# Altium schematic sheet 3_BLE.SchDoc: SHMP_MainBoard - Radio
size B; Author: Sébastien Gélinas; Organization: SmartHalo; Address1: 5445 de Gaspé; Address2: Montréal, QC; Address3: Canada; Address4: H2T 3B2; DocumentNumber: 4; Revision: 1; SheetNumber: 3; SheetTotal: 4
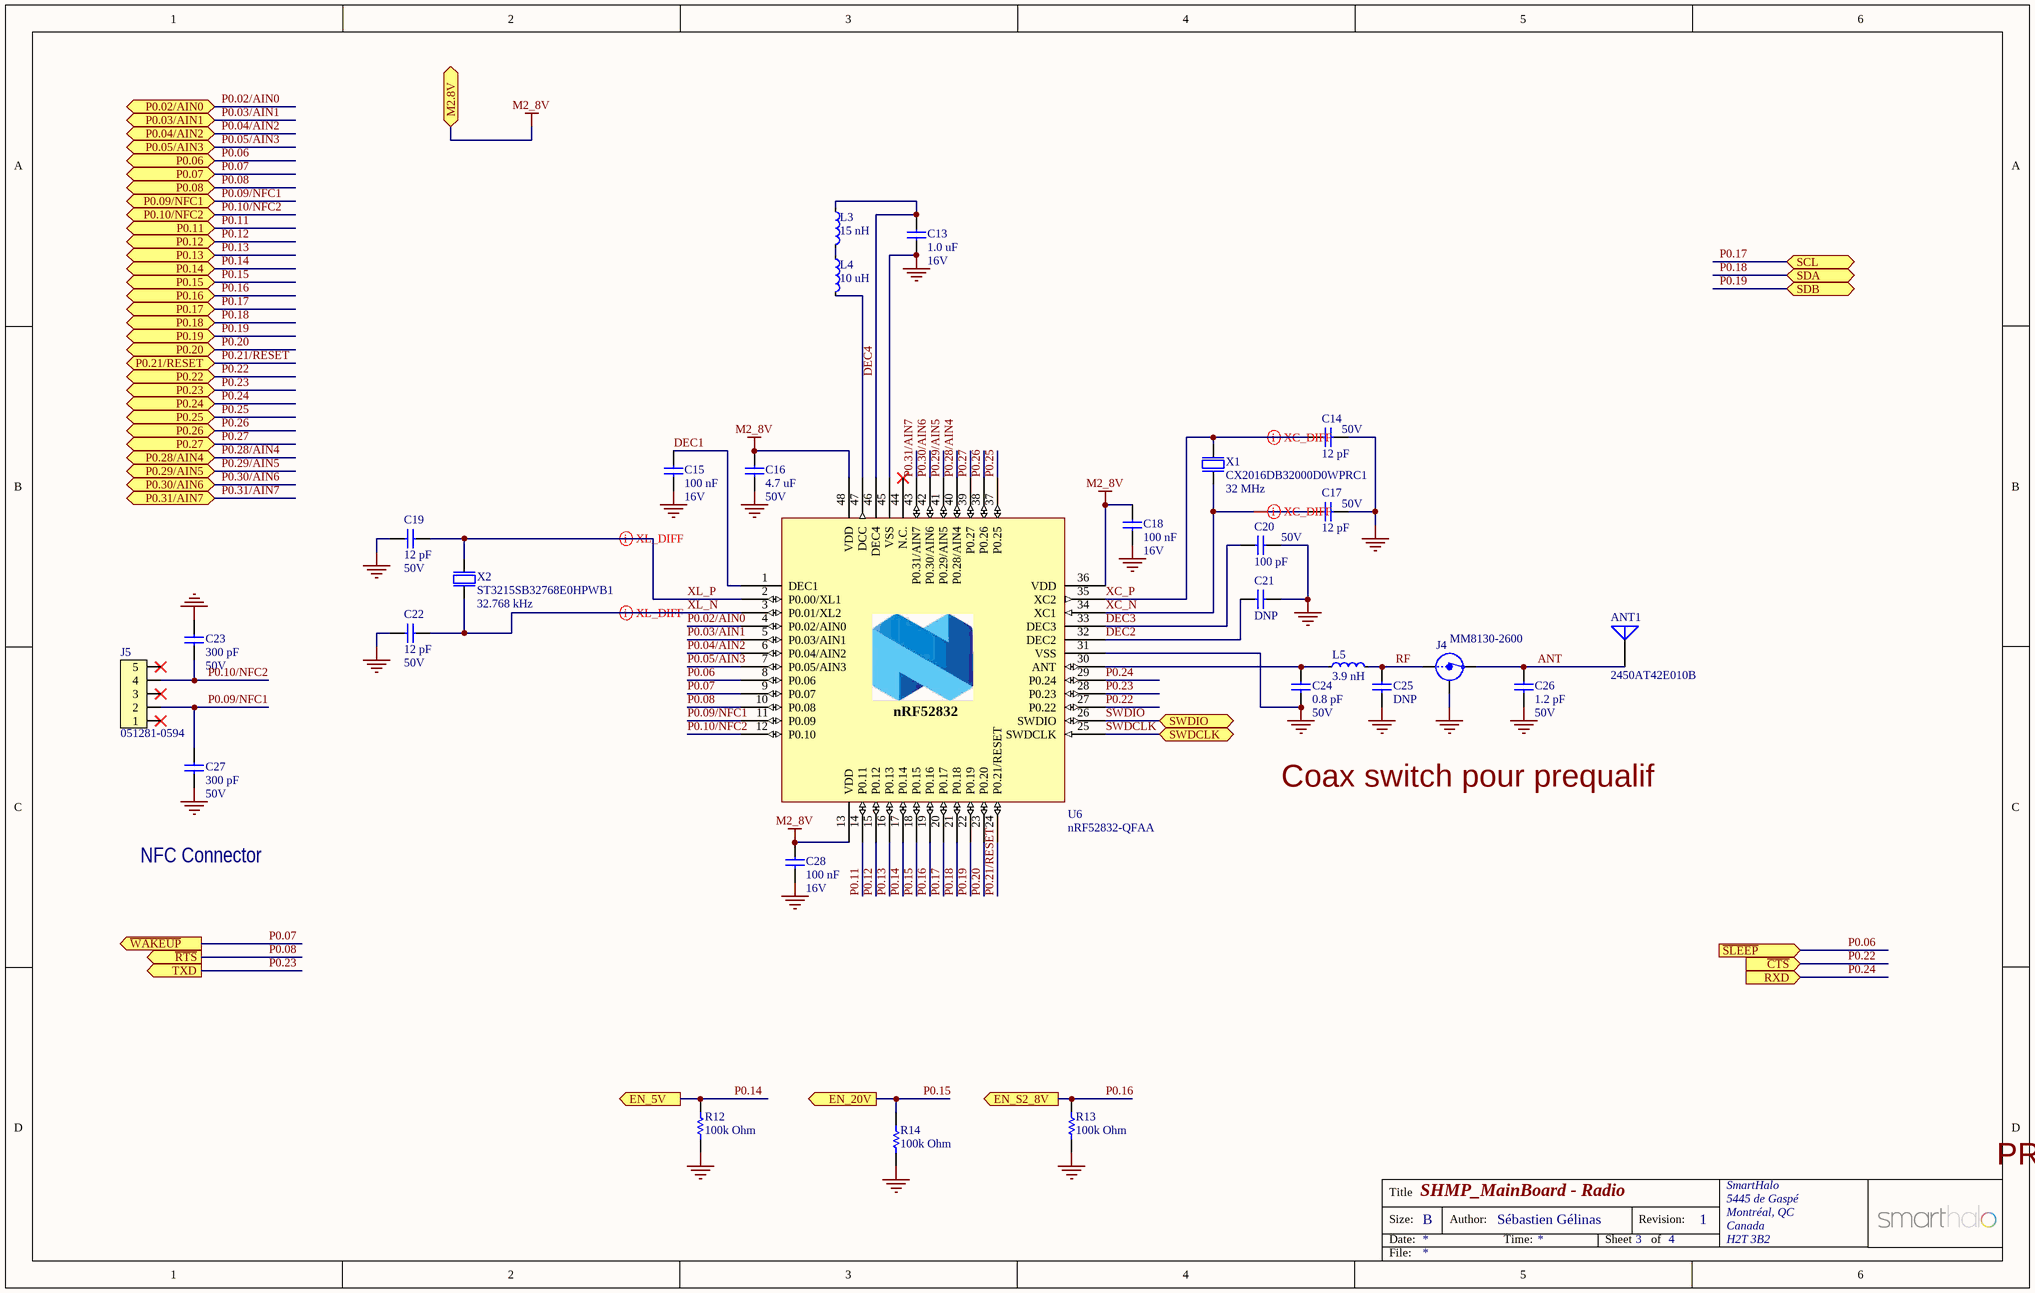
[diagram p0: 3_BLE.SchDoc]

## Parts
ANT1  2450AT42E010B  [2450AT42E010B]
C13  1.0 uF  Voltage Rating: 16V  [Varitron_CAP0603]
C14  12 pF  Voltage Rating: 50V  [Varitron_CAP0402]
C15  100 nF  Voltage Rating: 16V  [Varitron_CAP0402]
C16  4.7 uF  Voltage Rating: 50V  [Varitron_CAP0805]
C17  12 pF  Voltage Rating: 50V  [Varitron_CAP0402]
C18  100 nF  Voltage Rating: 16V  [Varitron_CAP0402]
C19  12 pF  Voltage Rating: 50V  [Varitron_CAP0402]
C20  100 pF  Voltage Rating: 50V  [Varitron_CAP0402]
C21  DNP  [Varitron_CAP0402]  (no BOM)
C22  12 pF  Voltage Rating: 50V  [Varitron_CAP0402]
C23  300 pF  Voltage Rating: 50V  [Varitron_CAP0402]
C24  0.8 pF  Voltage Rating: 50V  [Varitron_CAP0402]
C25  DNP  [Varitron_CAP0402]  (no BOM)
C26  1.2 pF  Voltage Rating: 50V  [Varitron_CAP0402]
C27  300 pF  Voltage Rating: 50V  [Varitron_CAP0402]
C28  100 nF  Voltage Rating: 16V  [Varitron_CAP0402]
J4  MM8130-2600  [COAXIAL-SWF]
J5  051281-0594  [Molex 051281-0594]
L3  15 nH  [Varitron_IND0402]
L4  10 uH  [Varitron_IND0603]
L5  3.9 nH  [Varitron_IND0402]
R12  100k Ohm  [Varitron_RES0402]
R13  100k Ohm  [Varitron_RES0402]
R14  100k Ohm  [Varitron_RES0402]
U6  nRF52832-QFAA  [QFN40P600X600X90-48N]
X1  CX2016DB32000D0WPRC1  Frequency: 32 MHz  [CRYSTAL_2016_4Pins]
X2  ST3215SB32768E0HPWB1  Frequency: 32.768 kHz  [CRYSTAL_3215_2Pins]

## Ports
EN_5V (out), EN_20V (out), EN_S2_8V (out), M2.8V, P0.02/AIN0, P0.03/AIN1, P0.04/AIN2, P0.05/AIN3, P0.06, P0.07, P0.08, P0.09/NFC1, P0.10/NFC2, P0.11, P0.12, P0.13, P0.14, P0.15, P0.16, P0.17, P0.18, P0.19, P0.20, P0.21/RESET, P0.22, P0.23, P0.24, P0.25, P0.26, P0.27, P0.28/AIN4, P0.29/AIN5, P0.30/AIN6, P0.31/AIN7, RXD (in), SCL (bidir), SDA (bidir), SDB (bidir), SWDCLK (bidir), SWDIO (bidir), TXD (out), ~{CTS} (in), ~{RTS} (out), ~{SLEEP} (in), ~{WAKEUP} (out)

## Nets
GND: ANT1.3(GND) ANT1.4(GND) C13.2 C14.2 C15.2 C16.2 C17.2 C18.2 C19.1 C20.2 C21.2 C22.1 C23.2 C24.1 C25.1 C26.1 C27.2 C28.2 J4.2(Shield) R12.1 R13.1 R14.2 U6.31(VSS) U6.45(VSS) U6.49(GND) X1.2(GND) X1.4(GND)
M2_8V: C16.1 C18.1 C28.1 U6.13(VDD) U6.36(VDD) U6.48(VDD) ; port M2.8V
ANT: ANT1.1(Feed) C26.2 J4.3(OUT)
DEC1: C15.1 U6.1(DEC1)
DEC2: C21.1 U6.32(DEC2)
DEC3: C20.1 U6.33(DEC3)
DEC4: C13.1 L3.1 U6.46(DEC4)
P0.02/AIN0: U6.4(P0.02/AIN0) ; port P0.02/AIN0
P0.03/AIN1: U6.5(P0.03/AIN1) ; port P0.03/AIN1
P0.04/AIN2: U6.6(P0.04/AIN2) ; port P0.04/AIN2
P0.05/AIN3: U6.7(P0.05/AIN3) ; port P0.05/AIN3
P0.06: U6.8(P0.06) ; port ~{SLEEP}, port P0.06
P0.07: U6.9(P0.07) ; port ~{WAKEUP}, port P0.07
P0.08: U6.10(P0.08) ; port ~{RTS}, port P0.08
P0.09/NFC1: C27.1 J5.2 U6.11(P0.09) ; port P0.09/NFC1
P0.10/NFC2: C23.1 J5.4 U6.12(P0.10) ; port P0.10/NFC2
P0.11: U6.14(P0.11) ; port P0.11
P0.12: U6.15(P0.12) ; port P0.12
P0.13: U6.16(P0.13) ; port P0.13
P0.14: R12.2 U6.17(P0.14) ; port EN_5V, port P0.14
P0.15: R14.1 U6.18(P0.15) ; port EN_20V, port P0.15
P0.16: R13.2 U6.19(P0.16) ; port EN_S2_8V, port P0.16
P0.17: U6.20(P0.17) ; port SCL, port P0.17
P0.18: U6.21(P0.18) ; port SDA, port P0.18
P0.19: U6.22(P0.19) ; port SDB, port P0.19
P0.20: U6.23(P0.20) ; port P0.20
P0.21/RESET: U6.24(P0.21/RESET) ; port P0.21/RESET
P0.22: U6.27(P0.22) ; port ~{CTS}, port P0.22
P0.23: U6.28(P0.23) ; port TXD, port P0.23
P0.24: U6.29(P0.24) ; port RXD, port P0.24
P0.25: U6.37(P0.25) ; port P0.25
P0.26: U6.38(P0.26) ; port P0.26
P0.27: U6.39(P0.27) ; port P0.27
P0.28/AIN4: U6.40(P0.28/AIN4) ; port P0.28/AIN4
P0.29/AIN5: U6.41(P0.29/AIN5) ; port P0.29/AIN5
P0.30/AIN6: U6.42(P0.30/AIN6) ; port P0.30/AIN6
P0.31/AIN7: U6.43(P0.31/AIN7) ; port P0.31/AIN7
RF: C25.2 J4.1(IN) L5.2
SWDCLK: U6.25(SWDCLK) ; port SWDCLK
SWDIO: U6.26(SWDIO) ; port SWDIO
XC_N: C17.1 U6.34(XC1) X1.3(out)
XC_P: C14.1 U6.35(XC2) X1.1(inp)
XL_N: C22.2 U6.3(P0.01/XL2) X2.2
XL_P: C19.2 U6.2(P0.00/XL1) X2.1
NetC24_2: C24.2 L5.1 U6.30(ANT)
NetL3_2: L3.2 L4.1
NetL4_2: L4.2 U6.47(DCC)

Not connected (* = marked no-connect by the designer): ANT1 2(NC); J5 1* 3* 5*; U6 44(N.C.)*

## Layout directives
differential pair: XC_N, XC_P, XL_N, XL_P

## Notes on the sheet
- Coax switch pour prequalif
- NFC Connector
- PRELIMINARY: DO NOT USE FOR PRODUCTION
- Title
- Size:
- Date:
- B
- Author:
- Time:
- Sheet
- Revision:
- of
- File:
- (in symbol nRF52832_QFAA) nRF52832

## Library data of the parts
ANT1 = 2450AT42E010B: CHIP ANTENNA, 2.45GHz, 5 x 2 x 1.5 mm body; Manufacturer: Johanson Technology; Part Number: 2450AT42E010B; Manufacturer Part Number: 2450AT42E010B; Supplier: Arrow Electronics; Footprint Name: CUSTOM(2 pins)
C13 = Varitron_CAP0603: 1.0 uF 16V X7R 10% 0603 (1608 Metric)  SMD; Case-EIA: 0603; Case-Metric: 1608; Tolerance: 10%; Technology: SMT; Temperature Coefficient: X7R; Value: 1.0 uF; Supplier: Arrow Electronics; Footprint Name: 0603
C14 C17 C19 C22 = Varitron_CAP0402: 12 pF 50V NP0 2% 0402 (1005 Metric)  SMD; Case-EIA: 0402; Case-Metric: 1005; Tolerance: 2%; Technology: SMT; Temperature Coefficient: NP0; Value: 12 pF; Supplier: Arrow Electronics; Footprint Name: 0402
C15 C18 C28 = Varitron_CAP0402: 100 nF 16V X7R 10% 0402 (1005 Metric)  SMD; Case-EIA: 0402; Case-Metric: 1005; Tolerance: 10%; Technology: SMT; Temperature Coefficient: X7R; Value: 100 nF; Supplier: Arrow Electronics; Footprint Name: 0402
C16 = Varitron_CAP0805: 4.7 uF 50V X5R 10% 0805 (2012 Metric)  SMD; Case-EIA: 0805; Case-Metric: 2012; Tolerance: 10%; Technology: SMT; Temperature Coefficient: X5R; Value: 4.7 uF; Supplier: Arrow Electronics; Footprint Name: 0805
C20 = Varitron_CAP0402: 100 pF 50V NP0 5% 0402 (1005 Metric)  SMD; Case-EIA: 0402; Case-Metric: 1005; Tolerance: 5%; Technology: SMT; Temperature Coefficient: NP0; Value: 100 pF; Supplier: Arrow Electronics; Footprint Name: 0402
C21 C25 = Varitron_CAP0402: C nF V TEMP TOL% 0402 (1005 Metric)  SMD; Case-EIA: 0402; Case-Metric: 1005; Tolerance: TOL; Value: C nF; Technology: SMT; Supplier: Arrow Electronics; Footprint Name: 0402
C23 C27 = Varitron_CAP0402: 300 pF 50V NP0 5% 0402 (1005 Metric)  SMD; Case-EIA: 0402; Case-Metric: 1005; Tolerance: 5%; Technology: SMT; Temperature Coefficient: NP0; Value: 300 pF; Supplier: Arrow Electronics; Footprint Name: 0402
C24 = Varitron_CAP0402: 0.8 pF 50V NP0 5% 0402 (1005 Metric)  SMD; Case-EIA: 0402; Case-Metric: 1005; Tolerance: 5%; Technology: SMT; Temperature Coefficient: NP0; Value: 0.8 pF; Supplier: Arrow Electronics; Footprint Name: 0402
C26 = Varitron_CAP0402: 1.2 pF 50V NP0 ±0.1 pF 0402 (1005 Metric)  SMD; Case-EIA: 0402; Case-Metric: 1005; Tolerance: ±0.1 pF; Technology: SMT; Temperature Coefficient: NP0; Value: 1.2 pF; Supplier: Arrow Electronics; Footprint Name: 0402
J4 = Coaxial-Internal-SW: Coaxial Connector with Switch; Manufacturer: Murata; 2nd source part number: 81-MM8130-2600RA2; Artikkelnr Noca: 55029011; Artikkelnr Simpro: N.A.; Part Number: MM8130-2600; Manufacturer Part Number: MM8130-2600; Datasheet: http://www.murata.com/products/catalog/pdf/o33e.pdf; LatestRevisionDate: 2014-04-24; Pin Count: 3; Publisher: Nordic Semiconductor; Published: 2014-04-24; Note: *; Supplier: Digi-Key; Supplier part number: 490-4981-1-ND; 2nd source Supplier: Mouser; Footprint Doc: COAXIAL-SWF; Footprint Name: CUSTOM(6 pins)
J5 = Molex 051281-0594: CONN FFC FPC 5POS 0.50MM R/A; Manufacturer: Molex; Artikkelnr Noca: N.A.; Part Number: Molex 051281-0594; Manufacturer Part Number: 051281-0594; Datasheet: http://www.molex.com/pdm_docs/sd/512810694_sd.pdf; Footprint Doc: Molex 051281-0594; LatestRevisionDate: 2015-06-22; Pin Count: 7; Publisher: Nordic Semiconductor; Published: 2015-06-22; Value: Molex 051281-0594; Note: *; Supplier: Digi-Key; Supplier part number: WM9836CT-ND; 2nd source Supplier: *; 2nd source part number: *; Artikkelnr Simpro: N.A.; Footprint Name: CUSTOM(5 pins)
L3 = Varitron_IND0402: 15 nH 5%, 320 mA, 0402 (1005 Metric)  SMD; Manufacturer: Taiyo Yuden; Manufacturer Part Number: HK100515NJ-T; Case-EIA: 0402; Case-Metric: 1005; SRF: MHz; DCR: Ohm; Tolerance: 5%; Technology: SMT; Part Number: HK100515NJ-T; Value: 15 nH; Supplier: Arrow Electronics; Footprint Name: 0402
L4 = Varitron_IND0603: 10 uH 10%, 80 mA, 0603 (1608 Metric)  SMD; Manufacturer: Taiyo Yuden; Manufacturer Part Number: LBMF1608T100K; Case-EIA: 0603; Case-Metric: 1608; SRF: MHz; DCR: Ohm; Tolerance: 10%; Technology: SMT; Part Number: LBMF1608T100K; Value: 10 uH; Supplier: Arrow Electronics; Footprint Name: 0603
L5 = Varitron_IND0402: 3.9 nH ±0.1 nH 0402 (1005 Metric)  SMD; Manufacturer: Murata; Manufacturer Part Number: LQP15MN3N9B02D; Case-EIA: 0402; Case-Metric: 1005; Tolerance: ±0.1 nH; SRF: MHz; DCR: Ohm; Technology: SMT; Part Number: LQP15MN3N9B02D; Value: 3.9 nH; Supplier: Arrow Electronics; Footprint Name: 0402
R12-R14 = Varitron_RES0402: 100k 0.063W 5%  0402 (1005 Metric)  SMD; Case-Metric: 1005; Case-EIA: 0402; Tolerance: 5%; Technology: SMT; Power: 0.063W; Value: 100k Ohm; Supplier: Arrow Electronics; Footprint Name: 0402
U6 = nRF52832_QFAA: Multi-protocol Bluetooth Low Energy and 2.4GHz proprietary system-on-chip; Manufacturer: Nordic Semiconductor; Artikkelnr Noca: N.A.; Part Number: nRF52832-QFAA; Manufacturer Part Number: nRF52832-QFAA; Datasheet: *; LatestRevisionDate: 2014-11-26; Pin Count: 48; Publisher: Nordic Semiconductor; Published: 2014-11-26; Note: *; Supplier: Arrow Electronics; Supplier part number: *; 2nd source Supplier: *; 2nd source part number: *; Footprint Doc: QFN-48; Artikkelnr Simpro: N.A.; Footprint Name: QFN48TP
X1 = CX2016DB32000D0WPRC1: XTAL 32 MHz, 8pF, 3.2 x 1.5 mm, ±20 ppm Tol, ±200 ppm Drift; Manufacturer: AVX/Kyocera; Frequency Drift: ±40 ppm; Manufacturer Part Number: CX2016DB32000D0WPRC1; Part Number: CX2016DB32000D0WPRC1; Frequency Tolerance: ±40 ppm; Load Capacitance: 8 pF; Supplier: Arrow Electronics; Footprint Name: XTAL2016
X2 = ST3215SB32768E0HPWB1: XTAL 32.768 kHz, 9pF, 3.2 x 1.5 mm, ±20 ppm Tol, ±200 ppm Drift; Manufacturer: AVX/Kyocera; Frequency Tolerance: ±20 ppm; Frequency Drift: ±200 ppm; Manufacturer Part Number: ST3215SB32768E0HPWB1; Part Number: ST3215SB32768E0HPWB1; Load Capacitance: 9 pF; Supplier: Arrow Electronics; Footprint Name: XTAL3215